# Altium schematic sheet water_heater_02.SchDoc
size A4
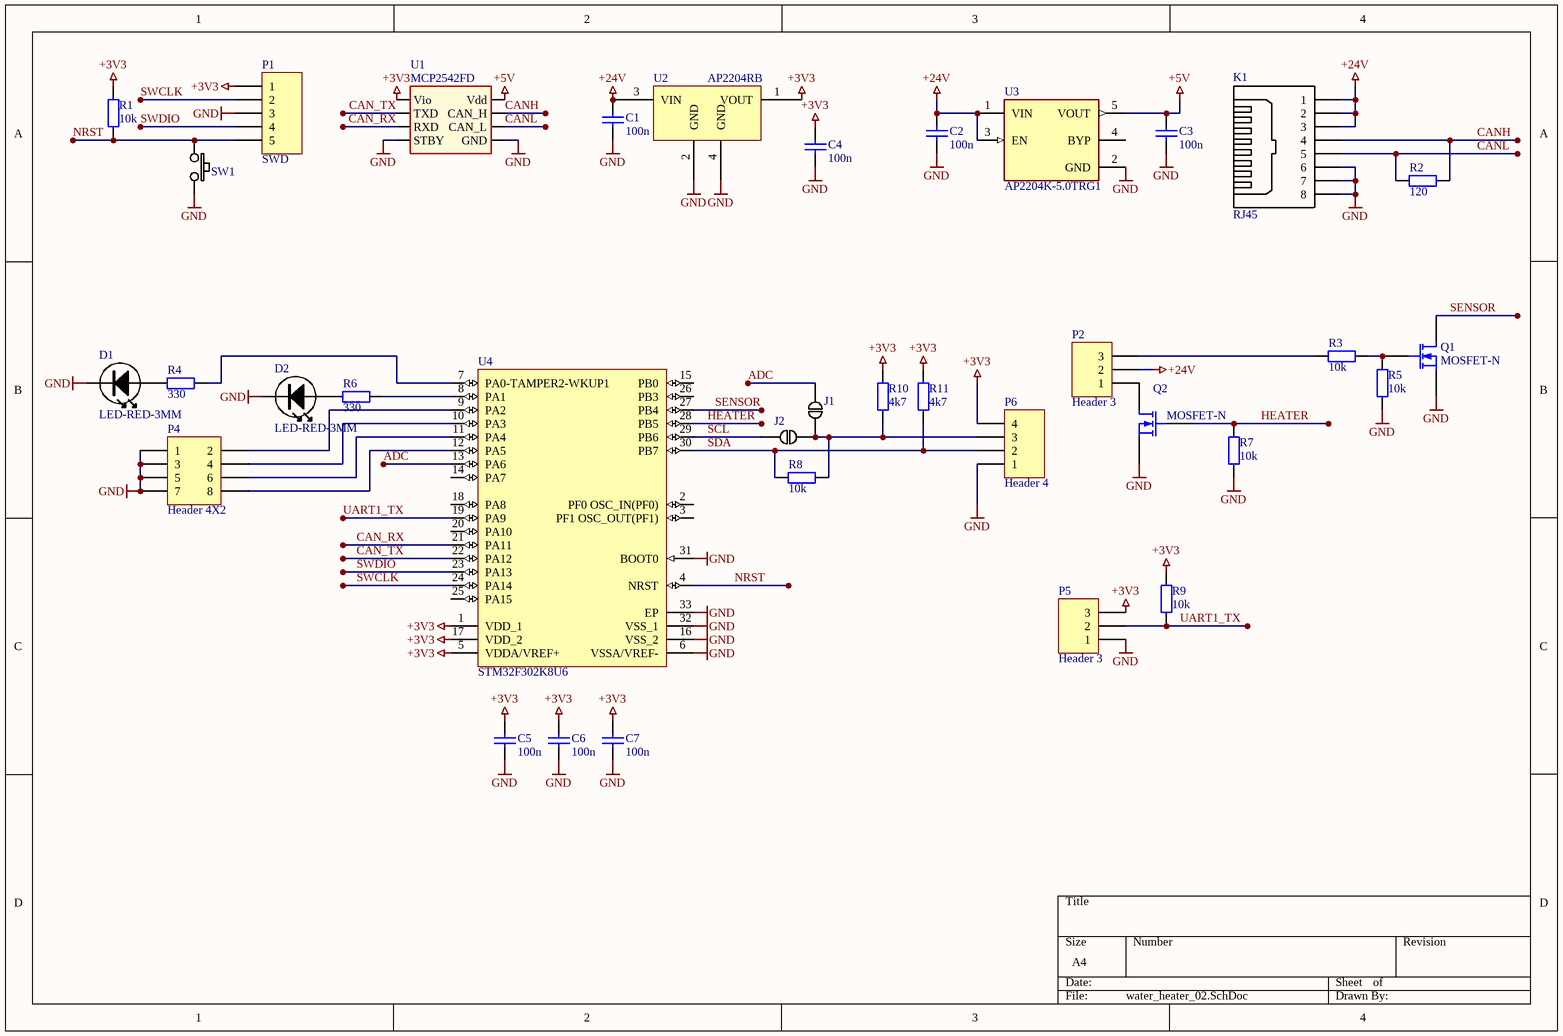
[diagram p0: water_heater_02.SchDoc]

## Parts
C1  value 100n  [0603C-GENERIC]  (hidden comment: Cap)
C2  value 100n  [0603C-GENERIC]  (hidden comment: Cap)
C3  value 100n  [0603C-GENERIC]  (hidden comment: Cap)
C4  value 100n  [0603C-GENERIC]  (hidden comment: Cap)
C5  value 100n  [0603C-GENERIC]  (hidden comment: Cap)
C6  value 100n  [0603C-GENERIC]  (hidden comment: Cap)
C7  value 100n  [0603C-GENERIC]  (hidden comment: Cap)
D1  LED-RED-3MM  [LED-3MM-GREEN]
D2  LED-RED-3MM  [LED-3MM-GREEN]
J1  (no value)  [BYPASS-MINI]
J2  (no value)  [BYPASS-MINI]
K1  RJ45  [rj45]
P1  SWD  [HDR1X5]
P2  Header 3  [XY301V-3P (5.00)]
P4  Header 4X2  [HDR2X4]
P5  Header 3  [XY301V-3P (5.00)]
P6  Header 4  [B4B-XH-A]
Q1  MOSFET-N  [SOT23-123]
Q2  MOSFET-N  [SOT23-123]
R1  value 10k  [0603R-GENERIC]  (hidden comment: Res2)
R2  value 120  [0603R-GENERIC]  (hidden comment: Res2)
R3  value 10k  [0603R-GENERIC]  (hidden comment: Res2)
R4  value 330  [0603R-GENERIC]  (hidden comment: Res2)
R5  value 10k  [0603R-GENERIC]  (hidden comment: Res2)
R6  value 330  [0603R-GENERIC]  (hidden comment: Res2)
R7  value 10k  [0603R-GENERIC]  (hidden comment: Res2)
R8  value 10k  [0603R-GENERIC]  (hidden comment: Res2)
R9  value 10k  [0603R-GENERIC]  (hidden comment: Res2)
R10  value 4k7  [0603R-GENERIC]  (hidden comment: Res2)
R11  value 4k7  [0603R-GENERIC]  (hidden comment: Res2)
SW1  SW-PB-BLACK-SMD  [PTS810]  (value not drawn)
U1  MCP2542FD  [SO8]
U2  AP2204RB  [SOT-89]
U3  AP2204K-5.0TRG1  [FP-SOT25-IPC_B]
U4  STM32F302K8U6  [UFQFPN32_M]

## Nets
+3V3: C4.2 C5.1 C6.1 C7.1 P1.1 P5.3 P6.4 R1.2 R9.1 R10.2 R11.2 U1.5(Vio) U2.1(VOUT) U4.1(VDD_1) U4.5(VDDA/VREF+) U4.17(VDD_2)
+5V: C3.2 U1.3(Vdd) U3.5(VOUT)
+24V: C1.2 C2.2 K1.1 K1.2 K1.3 P2.2 U2.3(VIN) U3.1(VIN) U3.3(EN)
GND: C1.1 C2.1 C3.1 C4.1 C5.2 C6.2 C7.2 D1.K D2.K K1.6 K1.7 K1.8 P1.3 P4.1 P4.3 P4.5 P4.7 P5.1 P6.1 Q1.3(S) Q2.3(S) R5.2 R7.2 SW1.2 U1.2(GND) U1.8(STBY) U2.2(GND) U2.4(GND) U3.2(GND) U4.6(VSSA/VREF-) U4.16(VSS_2) U4.31(BOOT0) U4.32(VSS_1) U4.33(EP)
ADC: J1.1 U4.13(PA6)
CAN_RX: U1.4(RXD) U4.21(PA11)
CAN_TX: U1.1(TXD) U4.22(PA12)
CANH: K1.4 R2.2 U1.7(CAN_H)
CANL: K1.5 R2.1 U1.6(CAN_L)
HEATER: Q2.2(G) R7.1 U4.28(PB5)
NRST: P1.5 R1.1 SW1.1 U4.4(NRST)
SCL: J2.2 U4.29(PB6)
SDA: P6.2 R8.1 R11.1 U4.30(PB7)
SENSOR: Q1.1(D) U4.27(PB4)
SWCLK: P1.2 U4.24(PA14)
SWDIO: P1.4 U4.23(PA13)
UART1_TX: P5.2 R9.2 U4.19(PA9)
NetD1_A: D1.A R4.1
NetD2_A: D2.A R6.1
NetJ1_2: J1.2 J2.1 P6.3 R8.2 R10.1
NetP2_1: P2.1 Q2.1(D)
NetP2_3: P2.3 R3.1
NetP4_2: P4.2 U4.9(PA2)
NetP4_4: P4.4 U4.10(PA3)
NetP4_6: P4.6 U4.11(PA4)
NetP4_8: P4.8 U4.12(PA5)
NetQ1_2: Q1.2(G) R3.2 R5.1
NetR4_2: R4.2 U4.7(PA0-TAMPER2-WKUP1)
NetR6_2: R6.2 U4.8(PA1)

Not connected (* = marked no-connect by the designer): U3 4(BYP); U4 2(PF0_OSC_IN(PF0)) 3(PF1_OSC_OUT(PF1)) 14(PA7) 15(PB0) 18(PA8) 20(PA10) 25(PA15) 26(PB3)

## Library data of the parts
C1-C7 = Cap: Capacitor; Published: 8-Jun-2000; LatestRevisionDate: 17-Jul-2002; LatestRevisionNote: Re-released for DXP Platform.; PackageReference: RAD-0.3; Publisher: Altium Limited; PackageDescription: Radial Cap, Thru-Hole; 2 Leads; 0.3 in Pin Spacing
D1 D2 = LED-GREEN-3MM
J1 J2 = BYPASS-MINI: SOLDERDOT BYPASS; Manufacturer Part Number 1: Board Feature; Reel: Open; Supplier 1: Solder-it-yourself; Manufacturer 1: Board feature
K1 = RJ45: Text Field1: STEWART CONNECTOR; Text Field2: SS-73100-047; Text Field3: DIGIKEY; Text Field4: 380-1053-ND
P1 = Header 5: Header, 5-Pin; LatestRevisionDate: 17-Jul-2002; LatestRevisionNote: Re-released for DXP Platform.; Publisher: Altium Limited
P2 P5 = Header 3: Header, 3-Pin; LatestRevisionDate: 17-Jul-2002; LatestRevisionNote: Re-released for DXP Platform.; Publisher: Altium Limited
P4 = Header 4X2: Header, 4-Pin, Dual row; LatestRevisionDate: 17-Jul-2002; LatestRevisionNote: Re-released for DXP Platform.; Publisher: Altium Limited
P6 = Header 4: Header, 4-Pin; LatestRevisionDate: 17-Jul-2002; LatestRevisionNote: Re-released for DXP Platform.; Publisher: Altium Limited
Q1 Q2 = MOSFET-N: N-Channel MOSFET; pin to pad: 1>3 2>1 3>2; Published: 8-Jun-2000; LatestRevisionDate: 17-Jul-2002; LatestRevisionNote: Re-released for DXP Platform.; PackageVersion: 1995/1996; PackageReference: E3; Publisher: Altium Limited; PackageDescription: TO, Flat Index; 3 In-Line, Axial Leads; Body Dia. 4.6mm; Lead Dia. 0.5 mm (max)
R1-R11 = Res2: Resistor; Published: 8-Jun-2000; LatestRevisionDate: 17-Jul-2002; LatestRevisionNote: Re-released for DXP Platform.; PackageReference: AXIAL-0.4; Publisher: Altium Limited; PackageDescription: Axial Device, Thru-Hole; 2 Leads; 0.4 in Pin Spacing
SW1 = SW-PB-BLACK-SMD: PUSHBUTTON SWITCH 6MM SMD
U3 = CMP-12756-000010-1: IC REG LINEAR 3.3V 150MA SOT23-5; Manufacturer Part Number: AP2202K-3.3TRG1; Manufacturer: Diodes Inc.; Max Junction Temp: +125°C; Max Supply Voltage: 13.2V; Standoff Height: 0.013mm; Dropout Voltage: 165mV; Nominal Supply Current: 95-1300uA; Accuracy Percentage: 1%; Min Supply Voltage: 2.5V; Output Type: Fixed; Number Of Outputs: 1; RoHS: TRUE; Category: IC; Digikey Description: IC REG LINEAR 3.3V 150MA SOT23-5; ComponentLink2URL: https://www.diodes.com/assets/Datasheets/AP2202.pdf; Lead Free: Yes; Octopart: https://octopart.com/ap2202k-3.3trg1-diodes+inc.-30954618; ComponentLink2Description: Datasheet; Temperature Range High: +125°C; Ipc Land Pattern Name: SOT95P280X115-5; Mouser Description: LDO Voltage Regulators 150mA CMOS LDO 3.3V; Temperature: -40°C to +125°C; Output Current: 150mA; Package: SOT25; Automotive: No; Temperature Range Low: -40°C; Height: 1.4mm; Device Class L2: Power Management ICs; Device Class L3: Voltage Regulators - Linear; Device Class L1: Integrated Circuits (ICs); Output Voltage: 3.3V; Footprint Url: https://www.diodes.com/assets/Package-Files/SOT25.pdf
U4 = CMP-0011-00001-1: ARM Cortex-M4 32-Bit MCU, 64 KB Flash, 16 KB SRAM, 24 I/Os, 2 to 3.6 V, -40 to 85 degC, 32-Pin UFQFPN, RoHS, Tray; Manufacturer: STMicroelectronics; SRAM: 16 KB; Number of I/O: 24; VBAT: 1.65 to 3.6 V; Core Size: 32 Bit; fHCLK: 72 MHz Max.; IDD: 0.15 uA Typ.; Flash Memory Size: 64 KB; ComponentLink2URL: http://www.st.com/st-web-ui/static/active/en/resource/technical/document/datasheet/DM00093333.pdf; VDD: 2 to 3.6 V; Temperature Range: -40 to 85 degC; ComponentLink1Description: Manufacturer URL; DatasheetVersion: Rev. 2; PartNumber: STM32F302K8U6; ComponentLink3URL: http://www.st.com/st-web-ui/static/active/en/resource/technical/document/datasheet/DM00093333.pdf; ComponentLink3Description: Package Specification; Packing: Tray; PackageDescription: 32-Pin, Ultra Thin, Fine Pitch Quad Flat No-Lead Package, Body 5 x 5 mm, Pitch 0.5 mm; RoHS: TRUE; Mounting Technology: Surface Mount; ComponentLink1URL: http://www.st.com/web/en/home.html; ComponentLink2Description: Datasheet